# Altium schematic sheet MPPT.SCHDOC
size A4
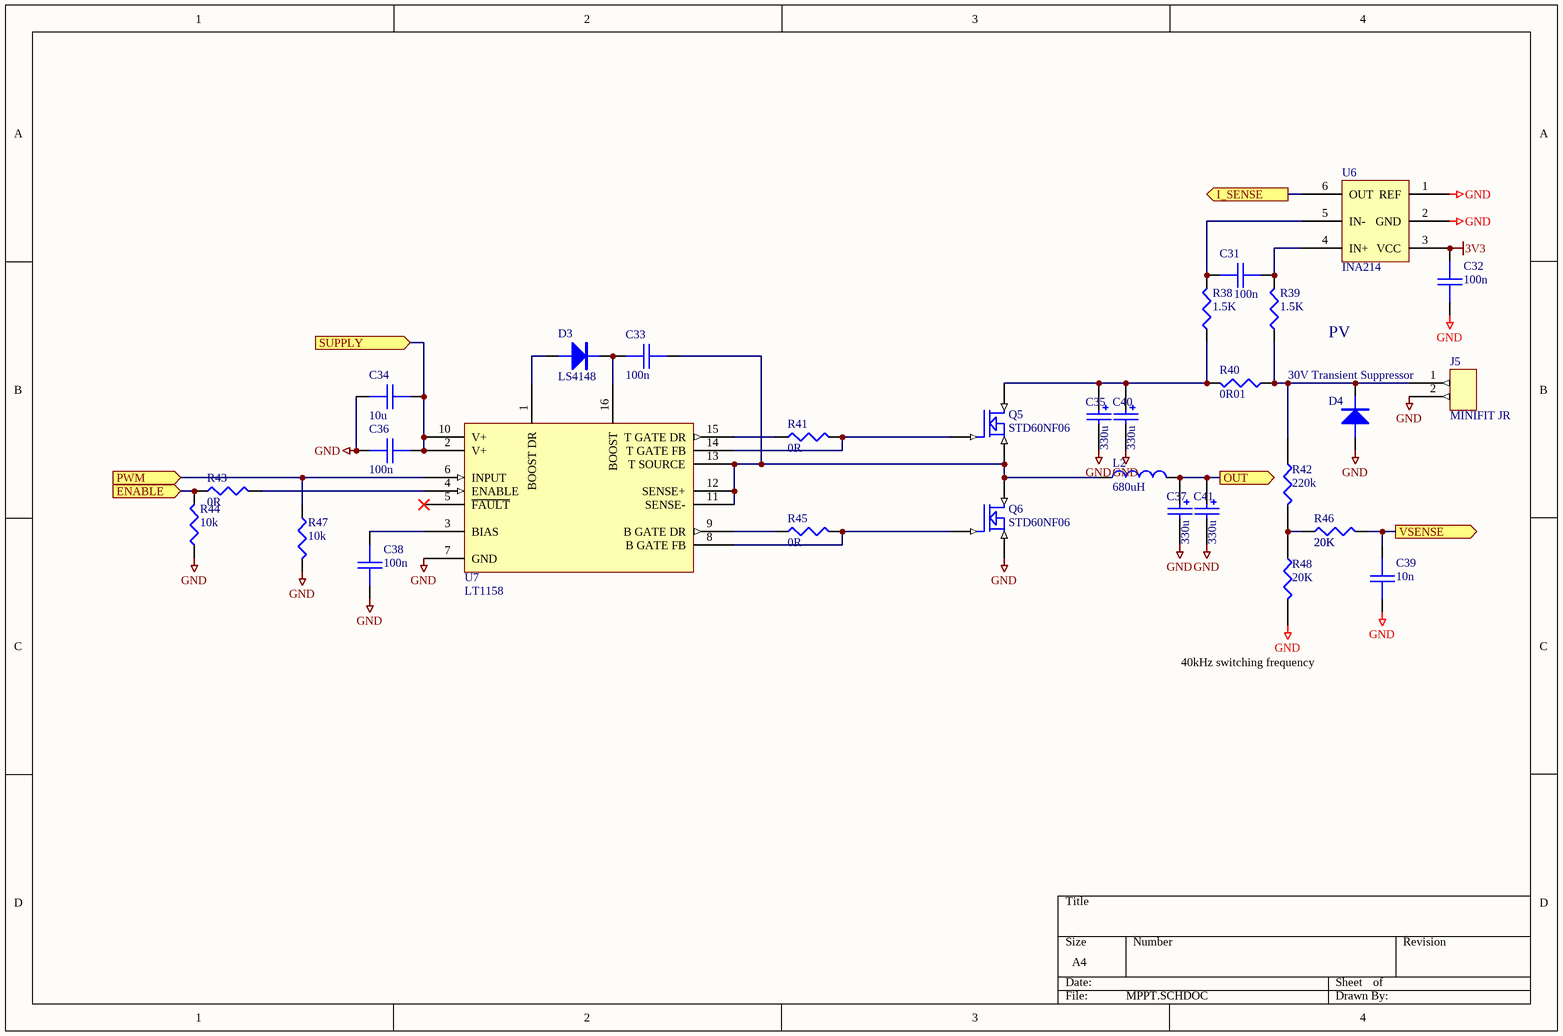
[diagram p0: MPPT.SCHDOC]

## Parts
C31  100n  [0603]
C32  100n  [0603]
C33  100n  [0603]
C34  10u  [1206]
C35  330u  [RAD0.2]
C36  100n  [0603]
C37  330u  [RAD0.2]
C38  100n  [0603]
C39  10n  [0603]
C40  330u  [RAD0.2]
C41  330u  [RAD0.2]
D3  LS4148  [QMELF]
D4  30V Transient Suppressor  [SMA]
J5  MINIFIT JR  [MINIFITJR-2]
L2  680uH  [Bourns2321-V-RC]
Q5  STD60NF06  [DPAK(3)]
Q6  STD60NF06  [DPAK(3)]
R38  1.5K  [0603]
R39  1.5K  [0603]
R40  0R01  [2010]
R41  0R  [0603]
R42  220k  [1206]
R43  0R  [0603]
R44  10k  [0603]
R45  0R  [0603]
R46  20K  [0603]
R47  10k  [0603]
R48  20K  [1206]
U6  INA214  [SC70-6]
U7  LT1158  [SOL16]

## Ports
ENABLE (in), I_SENSE (out), OUT (out), PWM (in), SUPPLY (in), VSENSE (out)

## Nets
3V3: C32.2 U6.3(VCC)
GND: C32.1 C34.1 C35.2 C36.2 C37.2 C38.2 C39.2 C40.2 C41.2 D4.A J5.2 Q6.3(S) R44.1 R47.2 R48.2 U6.1(REF) U6.2(GND) U7.7(GND)
ENABLE: R43.1 R44.2 ; port ENABLE
I_SENSE: U6.6(OUT) ; port I_SENSE
OUT: C37.1 C41.1 L2.2 ; port OUT
PWM: R47.1 U7.6(INPUT) ; port PWM
SUPPLY: C34.2 C36.1 U7.2(V+) U7.10(V+) ; port SUPPLY
VSENSE: C39.1 R46.2 ; port VSENSE
NetC31_1: C31.1 R38.2 U6.5(IN-)
NetC31_2: C31.2 R39.2 U6.4(IN+)
NetC33_1: C33.1 D3.K U7.16(BOOST)
NetC33_2: C33.2 L2.1 Q5.3(S) Q6.2(D) U7.11(SENSE-) U7.12(SENSE+) U7.13(T_SOURCE)
NetC35_1: C35.1 C40.1 Q5.2(D) R38.1 R40.2
NetC38_1: C38.1 U7.3(BIAS)
NetD3_A: D3.A U7.1(BOOST_DR)
NetD4_K: D4.K J5.1 R39.1 R40.1 R42.1
NetQ5_1: Q5.1(G) R41.2 U7.14(T_GATE_FB)
NetQ6_1: Q6.1(G) R45.2 U7.8(B_GATE_FB)
NetR41_1: R41.1 U7.15(T_GATE_DR)
NetR42_2: R42.2 R46.1 R48.1
NetR43_2: R43.2 U7.4(ENABLE)
NetR45_1: R45.1 U7.9(B_GATE_DR)

Not connected (* = marked no-connect by the designer): U7 5(~{FAULT})*

## Notes on the sheet
- PV
- 40kHz switching frequency

## Library data of the parts
C31-C33 C36 C38 C39 = CAP: Capacitor; Supplier: Stock
C34 = CAP: Capacitor; Order#: 1288206; Price: 2.51; Supplier: Stock
C35 C37 C40 C41 = CAP POL3: Polarized Capacitor (Surface Mount); Order#: 969-2290; Revision: July-2002: Re-released for DXP Platform.; Price: 1.01; Supplier: Farnell
D3 = DIODE: Order#: 739170; Price: 0.194; Supplier: Farnell
D4 = DIODE: Order#: 9802819; Price: 1.58; Supplier: Farnell
J5 = CON2: Order#: 1012166; FarnellPrice: 1.22; Digikey: WM3900-ND; DigikeyPrice: 0.99; Supplier: Farnell
L2 = Inductor: Order#: 1189584; Price: 9.32; Supplier: Farnell
Q5 Q6 = STD60NF06: Power MOSFET; Order#: 9935436; Farnell (Alternative): 8649774; Farnell (Alternative2): 9551484; Price: 1.96; Supplier: Farnell
R38 R39 R41 R43-R47 = RES1: Resistor
  R38 R39 R46: Supplier: Farnell
  R41 R43-R45 R47: Supplier: Stock
R40 = RES1: Resistor; Order#: 1100044; Price: 1.37; Supplier: Farnell
R42 = RES1: Order#: 3089587; Price: 1.57; Supplier: Farnell
R48 = RES1: Order#: 308-6252; Price: 1.57; Supplier: Farnell
U6 = INA214: High / Low side Current Sensor; Order#: 1606447; Supplier: Farnell
U7 = LT1158: Order#: 1273473; Price: 13.28; Supplier: Farnell